# Altium project roneCPUBoard-v10.PrjPCB
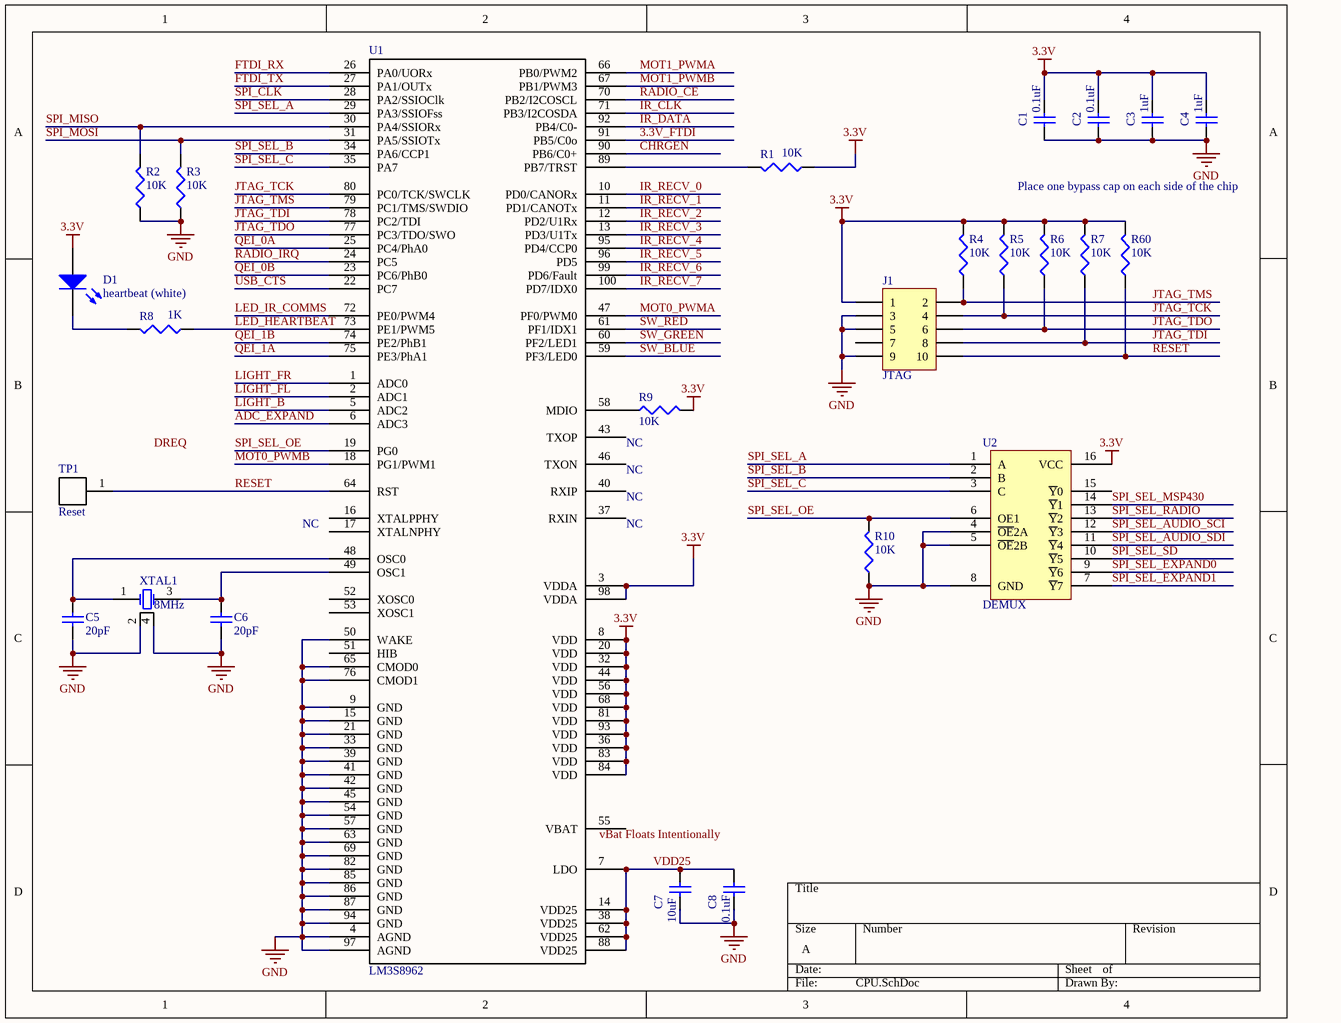
[diagram p0: CPU.SchDoc]
7 sheets, 179 parts. Net scope: global (net labels, ports and power ports of the same name join across sheets).
Board file: roneCPUBoard-v10.PcbDoc
Sheets:
  CPU.SchDoc
  USBHeaders.SchDoc
  IRComms.SchDoc
  LEDs.SchDoc
  LightSensorsButtons.SchDoc
  SoundChip.SchDoc
  TestPoints.SchDoc

## Sheet CPU.SchDoc
size A; PageSetup: Record=PageOptions|CenterHorizontal=True|CenterVertical=True|PrintScale=1.05|XCorrection=1.00|YCorrection=1.00|PrintKind=1|BorderSize=5000000|LeftOffset=0|BottomOffset=0|Orientation=2|PaperLength=1000|PaperWidth=1000|Scale=100|PaperSource=262|PrintQuality=600|MediaType=1|DitherType=10|PaperKind=Letter|PrintScaleMode=1

### Parts
C1  value 0.1uF  [CAPC1005L]  (hidden comment: Cap Semi)
C2  value 0.1uF  [CAPC1005L]  (hidden comment: Cap Semi)
C3  value 1uF  [CAPC1608L]  (hidden comment: Cap Semi)
C4  value 1uF  [CAPC1608L]  (hidden comment: Cap Semi)
C5  value 20pF  [CAPC1005L]  (hidden comment: Cap Semi)
C6  value 20pF  [CAPC1005L]  (hidden comment: Cap Semi)
C7  value 10uF  [CAPC1608L]  (hidden comment: Cap Semi)
C8  value 0.1uF  [CAPC1005L]  (hidden comment: Cap Semi)
D1  heartbeat (white)  [SurfaceMount(603)]
J1  JTAG  [JTAG-10]
R1  value 10K  [RESC1608L]  (hidden comment: Res3)
R2  value 10K  [RESC1608L]  (hidden comment: Res3)
R3  value 10K  [RESC1608L]  (hidden comment: Res3)
R4  value 10K  [RESC1608L]  (hidden comment: Res3)
R5  value 10K  [RESC1608L]  (hidden comment: Res3)
R6  value 10K  [RESC1608L]  (hidden comment: Res3)
R7  value 10K  [RESC1608L]  (hidden comment: Res3)
R8  value 1K  [RESC1608L]  (hidden comment: Res3)
R9  value 10K  [RESC1608L]  (hidden comment: Res3)
R10  value 10K  [RESC1608L]  (hidden comment: Res3)
R60  value 10K  [RESC1608L]  (hidden comment: Res3)
TP1  Reset  [TestPoint]
U1  LM3S8962  [LQFP-100]
U2  DEMUX  [TSSOP-16]
XTAL1  8MHz  [CRYSTAL]

### Nets
3.3V: C1.2 C2.2 C3.2 C4.2 D1.1(A) J1.1 R1.1 R4.2 R5.2 R6.2 R7.2 R9.2 R60.2 U1.3(VDDA) U1.8(VDD) U1.20(VDD) U1.32(VDD) U1.36(VDD) U1.44(VDD) U1.56(VDD) U1.68(VDD) U1.81(VDD) U1.83(VDD) U1.84(VDD) U1.93(VDD) U1.98(VDDA) U2.16(VCC)
3.3V_FTDI: U1.91(PB5/C0o)
GND: C1.1 C2.1 C3.1 C4.1 C5.1 C6.1 C7.1 C8.1 J1.3 J1.5 J1.9 R2.1 R3.1 R10.1 U1.4(AGND) U1.9(GND) U1.15(GND) U1.21(GND) U1.33(GND) U1.39(GND) U1.41(GND) U1.42(GND) U1.45(GND) U1.50(WAKE) U1.54(GND) U1.57(GND) U1.63(GND) U1.65(CMOD0) U1.69(GND) U1.76(CMOD1) U1.82(GND) U1.85(GND) U1.86(GND) U1.87(GND) U1.94(GND) U1.97(AGND) U2.4(~{OE}2A) U2.5(~{OE}2B) U2.8(GND) XTAL1.2(GND) XTAL1.4(GND)
ADC_EXPAND: U1.6(ADC3)
CHRGEN: U1.90(PB6/C0+)
FTDI_RX: U1.26(PA0/UORx)
FTDI_TX: U1.27(PA1/OUTx)
IR_CLK: U1.71(PB3/I2COSDA)
IR_DATA: U1.92(PB4/C0-)
IR_RECV_0: U1.10(PD0/CANORx)
IR_RECV_1: U1.11(PD1/CANOTx)
IR_RECV_2: U1.12(PD2/U1Rx)
IR_RECV_3: U1.13(PD3/U1Tx)
IR_RECV_4: U1.95(PD4/CCP0)
IR_RECV_5: U1.96(PD5)
IR_RECV_6: U1.99(PD6/Fault)
IR_RECV_7: U1.100(PD7/IDX0)
JTAG_TCK: J1.4 R5.1 U1.80(PC0/TCK/SWCLK)
JTAG_TDI: J1.8 R7.1 U1.78(PC2/TDI)
JTAG_TDO: J1.6 R6.1 U1.77(PC3/TDO/SWO)
JTAG_TMS: J1.2 R4.1 U1.79(PC1/TMS/SWDIO)
LED_HEARTBEAT: R8.1 U1.73(PE1/PWM5)
LED_IR_COMMS: U1.72(PE0/PWM4)
LIGHT_B: U1.5(ADC2)
LIGHT_FL: U1.2(ADC1)
LIGHT_FR: U1.1(ADC0)
MOT0_PWMA: U1.47(PF0/PWM0)
MOT0_PWMB: U1.18(PG1/PWM1)
MOT1_PWMA: U1.66(PB0/PWM2)
MOT1_PWMB: U1.67(PB1/PWM3)
QEI_0A: U1.25(PC4/PhA0)
QEI_0B: U1.23(PC6/PhB0)
QEI_1A: U1.75(PE3/PhA1)
QEI_1B: U1.74(PE2/PhB1)
RADIO_CE: U1.70(PB2/I2COSCL)
RADIO_IRQ: U1.24(PC5)
RESET: J1.10 R60.1 TP1.1 U1.64(RST)
SPI_CLK: U1.28(PA2/SSIOClk)
SPI_MISO: R2.2 U1.30(PA4/SSIORx)
SPI_MOSI: R3.2 U1.31(PA5/SSIOTx)
SPI_SEL_A: U1.29(PA3/SSIOFss) U2.1(A)
SPI_SEL_AUDIO_SCI: U2.12(~{Y}3)
SPI_SEL_AUDIO_SDI: U2.11(~{Y}4)
SPI_SEL_B: U1.34(PA6/CCP1) U2.2(B)
SPI_SEL_C: U1.35(PA7) U2.3(C)
SPI_SEL_EXPAND0: U2.9(~{Y}6)
SPI_SEL_EXPAND1: U2.7(~{Y}7)
SPI_SEL_MSP430: U2.14(~{Y}1)
SPI_SEL_OE: R10.2 U1.19(PG0) U2.6(OE1)
SPI_SEL_RADIO: U2.13(~{Y}2)
SPI_SEL_SD: U2.10(~{Y}5)
SW_BLUE: U1.59(PF3/LED0)
SW_GREEN: U1.60(PF2/LED1)
SW_RED: U1.61(PF1/IDX1)
USB_CTS: U1.22(PC7)
VDD25: C7.2 C8.2 U1.7(LDO) U1.14(VDD25) U1.38(VDD25) U1.62(VDD25) U1.88(VDD25)
NetC5_2: C5.2 U1.48(OSC0) XTAL1.1(OSC1)
NetC6_2: C6.2 U1.49(OSC1) XTAL1.3(OSC2)
NetD1_2: D1.2(K) R8.2
NetR1_2: R1.2 U1.89(PB7/TRST)
NetR9_1: R9.1 U1.58(MDIO)

Not connected (* = marked no-connect by the designer): J1 7; U1 16(XTALPPHY) 17(XTALNPHY) 37(RXIN) 40(RXIP) 43(TXOP) 46(TXON) 51(HIB) 52(XOSC0) 53(XOSC1) 55(VBAT); U2 15(~{Y}0)

### Notes on the sheet
- Place one bypass cap on each side of the chip
- NC
- (near U1) NC
- (near U1) vBat Floats Intentionally
- Labels drawn without touching a wire or pin: DREQ

### Library data of the parts
C1-C8 = Cap Semi: Capacitor (Semiconductor SIM Model); Published: 8-Jun-2000; LatestRevisionDate: 29-May-2009; LatestRevisionNote: IPC-7351 Footprint Added.; PackageReference: C1206; Publisher: Altium Limited; PackageDescription: Chip Capacitor
D1 = LED
J1 = Header 5X2H: Header, 5-Pin, Dual row, Right Angle; LatestRevisionDate: 17-Jul-2002; LatestRevisionNote: Re-released for DXP Platform.; Publisher: Altium Limited
R1-R10 R60 = Res3: Resistor; Published: 8-Jun-2000; LatestRevisionDate: 29-May-2009; LatestRevisionNote: IPC-7351 Footprint Added.; PackageReference: J1-0603; Publisher: Altium Limited; PackageDescription: Chip Resistor
TP1 = TestPoint
XTAL1 = Crystal

## Sheet USBHeaders.SchDoc
size A
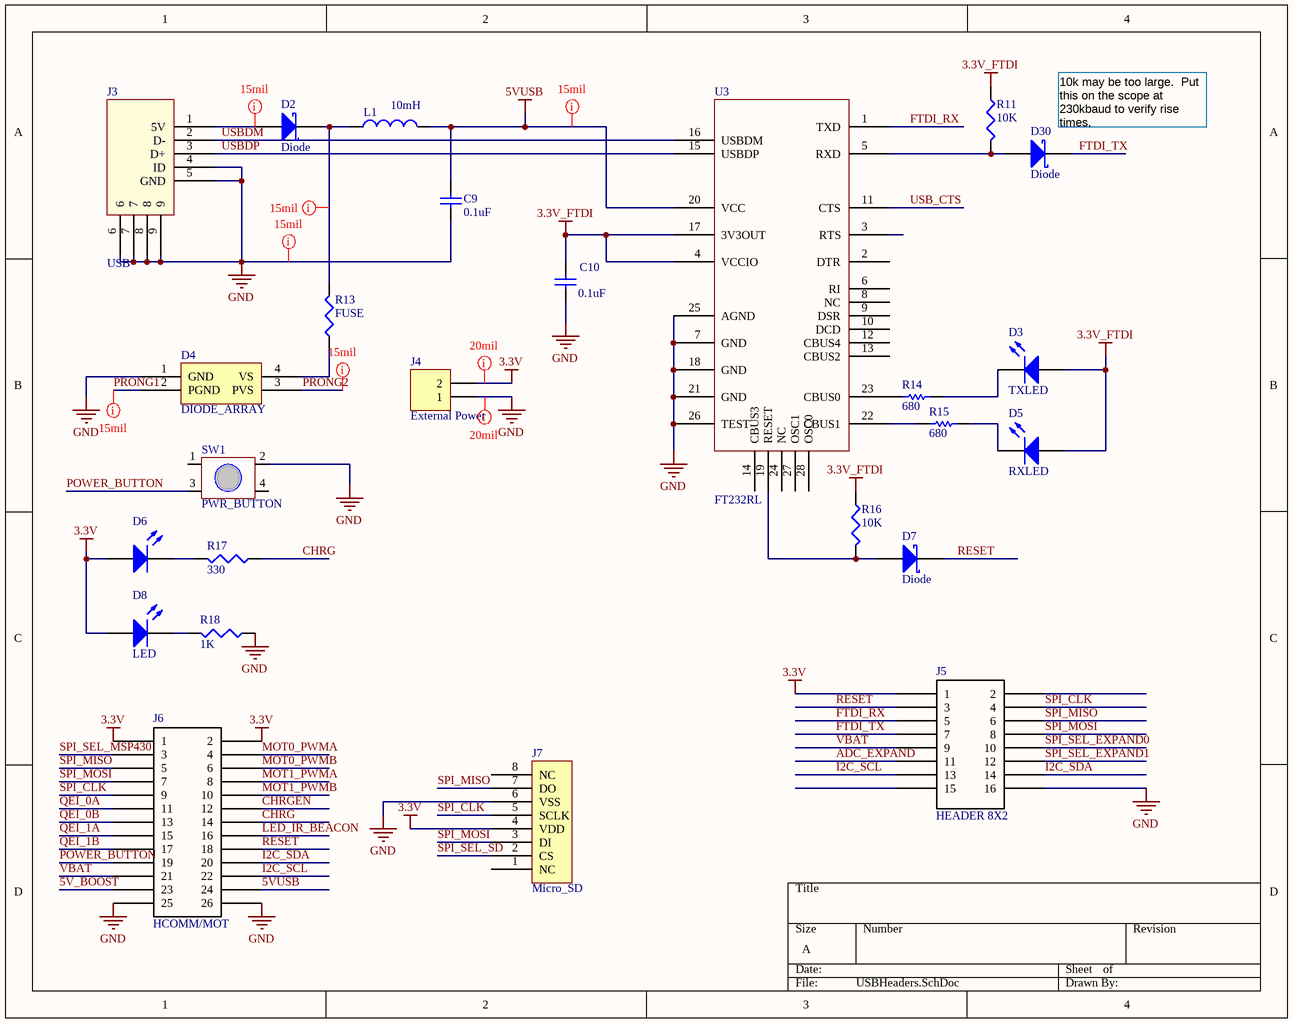
[diagram p1: USBHeaders.SchDoc]

### Parts
C9  value 0.1uF  [CAPC1005L]
C10  value 0.1uF  [CAPC1005L]
D2  Diode  [SurfaceMount(603)]
D3  TXLED  [INDC2012L]
D4  DIODE_ARRAY  [SOT143]
D5  RXLED  [INDC2012L]
D6  Charge  [INDC2012L]  (value not drawn)
D7  Diode  [SurfaceMount(603)]
D8  LED  [SurfaceMount(603)]
D30  Diode  [SurfaceMount(603)]
J3  USB  [USB Minib (thru-hole)]
J4  External Power  [HDR1X2]
J5  HEADER 8X2  [HEADERSM 8X2]
J6  HCOMM/MOT  [HeaderSM 13x2]
J7  Micro_SD  [MICRO_SD]
L1  value 10mH  [INDC2012L]  (hidden comment: Inductor)
R11  value 10K  [RESC1608L]  (hidden comment: Res3)
R13  value FUSE  [RESC3225L]  (hidden comment: Res3)
R14  value 680  [RESC1608L]
R15  value 680  [RESC1608L]
R16  value 10K  [RESC1608L]  (hidden comment: Res3)
R17  value 330  [RESC1608L]  (hidden comment: Res3)
R18  value 1K  [RESC1608L]  (hidden comment: Res3)
SW1  PWR_BUTTON  [SwitchTall-TL330]
U3  FT232RL  [SSOP-28]

### Nets
3.3V: D6.1(A) D8.1(A) J4.2 J5.1 J6.1 J6.2 J7.4(VDD)
3.3V_FTDI: C10.2 D3.1(A) D5.1(A) R11.1 R16.1 U3.4(VCCIO) U3.17(3V3OUT)
5V_BOOST: J6.23
5VUSB: C9.2 J6.24 L1.2 U3.20(VCC)
GND: C9.1 C10.1 D4.1(GND) J3.4(ID) J3.5(GND) J3.6 J3.7 J3.8 J3.9 J4.1 J5.16 J6.25 J6.26 J7.6(VSS) R18.1 SW1.2 U3.7(GND) U3.18(GND) U3.21(GND) U3.25(AGND) U3.26(TEST)
ADC_EXPAND: J5.11
CHRG: J6.14 R17.1
CHRGEN: J6.12
FTDI_RX: J5.5 U3.1(TXD)
FTDI_TX: D30.1(K) J5.7
I2C_SCL: J5.13 J6.22
I2C_SDA: J5.14 J6.20
LED_IR_BEACON: J6.16
MOT0_PWMA: J6.4
MOT0_PWMB: J6.6
MOT1_PWMA: J6.8
MOT1_PWMB: J6.10
POWER_BUTTON: J6.19 SW1.3
PRONG1: D4.2(PGND)
PRONG2: D4.3(PVS)
QEI_0A: J6.11
QEI_0B: J6.13
QEI_1A: J6.15
QEI_1B: J6.17
RESET: D7.1(K) J5.3 J6.18
SPI_CLK: J5.4 J6.9 J7.5(SCLK)
SPI_MISO: J5.6 J6.5 J7.7(DO)
SPI_MOSI: J5.8 J6.7 J7.3(DI)
SPI_SEL_EXPAND0: J5.10
SPI_SEL_EXPAND1: J5.12
SPI_SEL_MSP430: J6.3
SPI_SEL_SD: J7.2(CS)
USB_CTS: U3.11(CTS)
USBDM: J3.2(D-) U3.16(USBDM)
USBDP: J3.3(D+) U3.15(USBDP)
VBAT: J5.9 J6.21
NetD2_1: D2.1(K) L1.1 R13.2
NetD2_2: D2.2(A) J3.1(5V)
NetD3_2: D3.2(K) R14.2
NetD4_4: D4.4(VS) R13.1
NetD5_2: D5.2(K) R15.2
NetD6_2: D6.2(K) R17.2
NetD7_2: D7.2(A) R16.2 U3.19(RESET)
NetD8_2: D8.2(K) R18.2
NetD30_2: D30.2(A) R11.2 U3.5(RXD)
NetR14_1: R14.1 U3.23(CBUS0)
NetR15_1: R15.1 U3.22(CBUS1)

Not connected (* = marked no-connect by the designer): J5 2 15; J7 1(NC) 8(NC); SW1 1 4; U3 2(DTR) 3(RTS) 6(RI) 8(NC) 9(DSR) 10(DCD) 12(CBUS4) 13(CBUS2) 14(CBUS3) 24(NC) 27(OSC1) 28(OSC0)

### Layout directives
rule Width Constraint [Pref Width = 15mil    Min Width = 8mil    Max Width = 20mil]: 3.3V, GND
rule Width Constraint [Pref Width = 8mil    Min Width = 8mil    Max Width = 15mil]: 5VUSB, GND, NetD2_1, NetD2_2, PRONG1, PRONG2

### Notes on the sheet
- (near D30) 10k may be too large.  Put this on the scope at 230kbaud to verify rise times.

### Library data of the parts
C9 C10 = Cap: Capacitor; Published: 8-Jun-2000; LatestRevisionDate: 17-Jul-2002; LatestRevisionNote: Re-released for DXP Platform.; PackageReference: RAD-0.3; Publisher: Altium Limited
D2 D7 D30 = SchottkeyDiode
D3 D5 D6 = LED2: Typical RED, GREEN, YELLOW, AMBER GaAs LED; Published: 8-Jun-2000; LatestRevisionDate: 17-Jul-2002; LatestRevisionNote: Re-released for DXP Platform.; PackageVersion: Feb-2002; PackageReference: 3.2X1.6X1.1; Publisher: Altium Limited
D4 = SCHOTTKEY_DIODE_ARRAY
J3 = USB-ConnTH
J4 = Header 2: Header, 2-Pin; LatestRevisionDate: 17-Jul-2002; LatestRevisionNote: Re-released for DXP Platform.; Publisher: Altium Limited
J5 = HEADERS 8X2
J6 = HCOMM/HMOT: Header, 2X20, 50mil, IDC
L1 = Inductor: Code_IEC: 1005; Published: 8-Jun-2000; LatestRevisionDate: 29-May-2009; LatestRevisionNote: IPC-7351 Footprint Added.; PackageReference: 0402-A; Publisher: Altium Limited; PackageDescription: Chip Inductor; Code_JEITA: 0402
R11 R13 R16-R18 = Res3: Resistor; Published: 8-Jun-2000; LatestRevisionDate: 29-May-2009; LatestRevisionNote: IPC-7351 Footprint Added.; PackageReference: J1-0603; Publisher: Altium Limited; PackageDescription: Chip Resistor
R14 R15 = Res1: Resistor; Published: 8-Jun-2000; LatestRevisionDate: 17-Jul-2002; LatestRevisionNote: Re-released for DXP Platform.; PackageReference: AXIAL-0.3; Publisher: Altium Limited
SW1 = Switch-TL330

## Sheet IRComms.SchDoc
size A
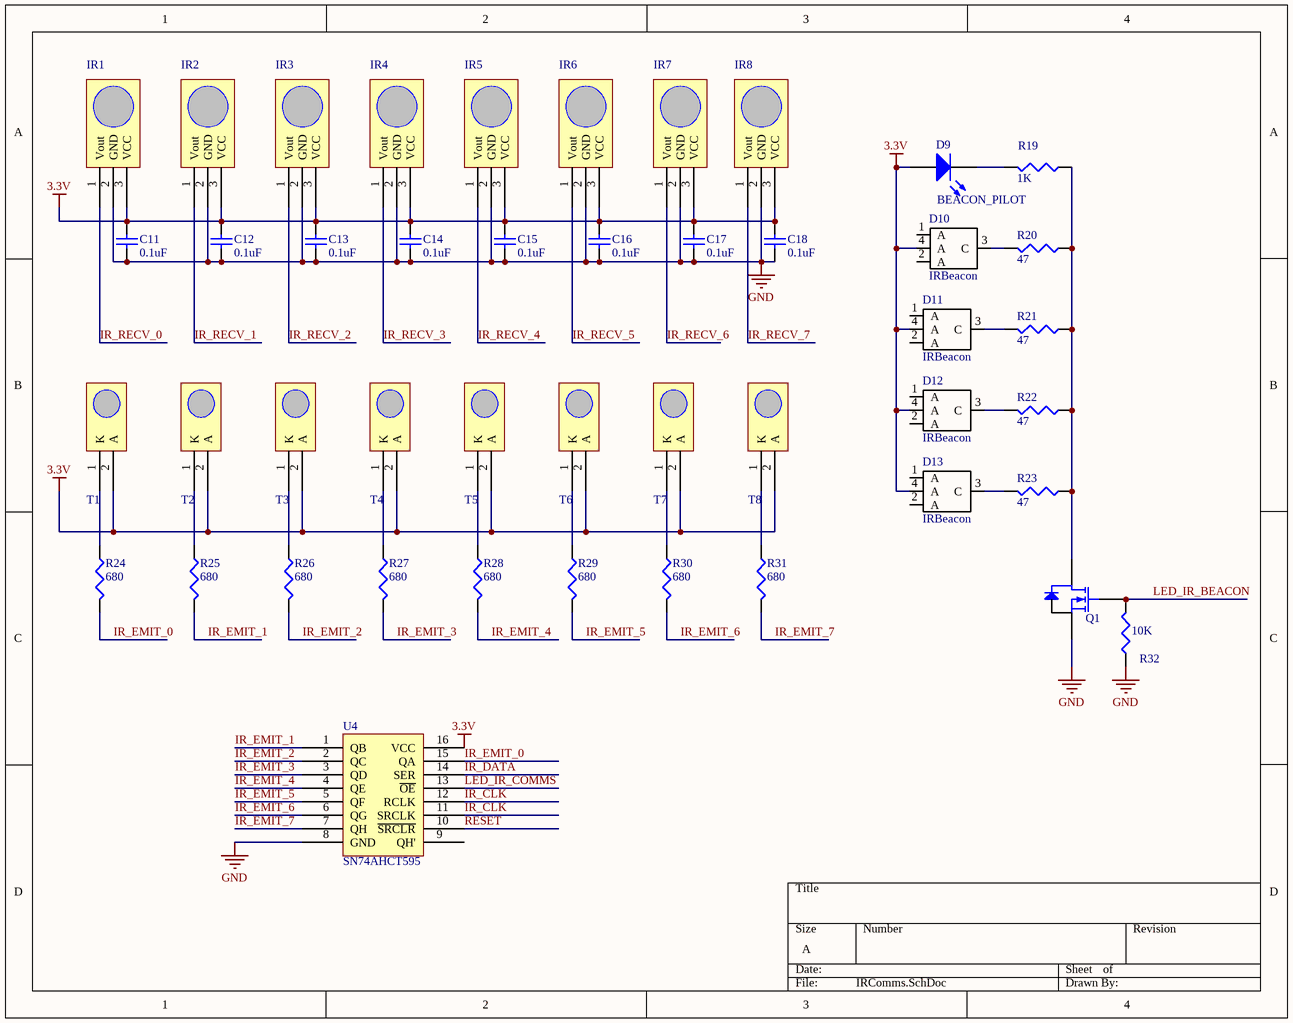
[diagram p2: IRComms.SchDoc]

### Parts
C11  value 0.1uF  [CAPC1005L]  (hidden comment: Cap Semi)
C12  value 0.1uF  [CAPC1005L]  (hidden comment: Cap Semi)
C13  value 0.1uF  [CAPC1005L]  (hidden comment: Cap Semi)
C14  value 0.1uF  [CAPC1005L]  (hidden comment: Cap Semi)
C15  value 0.1uF  [CAPC1005L]  (hidden comment: Cap Semi)
C16  value 0.1uF  [CAPC1005L]  (hidden comment: Cap Semi)
C17  value 0.1uF  [CAPC1005L]  (hidden comment: Cap Semi)
C18  value 0.1uF  [CAPC1005L]  (hidden comment: Cap Semi)
D9  BEACON_PILOT  [SurfaceMount(603)]
D10  IRBeacon  [IRBeacon]
D11  IRBeacon  [IRBeacon]
D12  IRBeacon  [IRBeacon]
D13  IRBeacon  [IRBeacon]
IR1  GP1UX31QS  [GP1UX31QS]  (value not drawn)
IR2  GP1UX31QS  [GP1UX31QS]  (value not drawn)
IR3  GP1UX31QS  [GP1UX31QS]  (value not drawn)
IR4  GP1UX31QS  [GP1UX31QS]  (value not drawn)
IR5  GP1UX31QS  [GP1UX31QS]  (value not drawn)
IR6  GP1UX31QS  [GP1UX31QS]  (value not drawn)
IR7  GP1UX31QS  [GP1UX31QS]  (value not drawn)
IR8  GP1UX31QS  [GP1UX31QS]  (value not drawn)
Q1  Mosfet  [SOT-23]  (value not drawn)
R19  value 1K  [RESC1608L]  (hidden comment: Res3)
R20  value 47  [RESC1608L]  (hidden comment: Res3)
R21  value 47  [RESC1608L]  (hidden comment: Res3)
R22  value 47  [RESC1608L]  (hidden comment: Res3)
R23  value 47  [RESC1608L]  (hidden comment: Res3)
R24  value 680  [RESC1608L]  (hidden comment: Res3)
R25  value 680  [RESC1608L]  (hidden comment: Res3)
R26  value 680  [RESC1608L]  (hidden comment: Res3)
R27  value 680  [RESC1608L]  (hidden comment: Res3)
R28  value 680  [RESC1608L]  (hidden comment: Res3)
R29  value 680  [RESC1608L]  (hidden comment: Res3)
R30  value 680  [RESC1608L]  (hidden comment: Res3)
R31  value 680  [RESC1608L]  (hidden comment: Res3)
R32  value 10K  [RESC1608L]  (hidden comment: Res3)
T1  LN54  [LN54]  (value not drawn)
T2  LN54  [LN54]  (value not drawn)
T3  LN54  [LN54]  (value not drawn)
T4  LN54  [LN54]  (value not drawn)
T5  LN54  [LN54]  (value not drawn)
T6  LN54  [LN54]  (value not drawn)
T7  LN54  [LN54]  (value not drawn)
T8  LN54  [LN54]  (value not drawn)
U4  SN74AHCT595  [TSSOP-16]

### Nets
3.3V: C11.2 C12.2 C13.2 C14.2 C15.2 C16.2 C17.2 C18.2 D9.1(A) D10.4(A) D11.4(A) D12.4(A) D13.4(A) IR1.3(VCC) IR2.3(VCC) IR3.3(VCC) IR4.3(VCC) IR5.3(VCC) IR6.3(VCC) IR7.3(VCC) IR8.3(VCC) T1.2(A) T2.2(A) T3.2(A) T4.2(A) T5.2(A) T6.2(A) T7.2(A) T8.2(A) U4.16(VCC)
GND: C11.1 C12.1 C13.1 C14.1 C15.1 C16.1 C17.1 C18.1 IR1.2(GND) IR2.2(GND) IR3.2(GND) IR4.2(GND) IR5.2(GND) IR6.2(GND) IR7.2(GND) IR8.2(GND) Q1.2(S) R32.1 U4.8(GND)
IR_CLK: U4.11(SRCLK) U4.12(RCLK)
IR_DATA: U4.14(SER)
IR_EMIT_0: R24.2 U4.15(QA)
IR_EMIT_1: R25.2 U4.1(QB)
IR_EMIT_2: R26.2 U4.2(QC)
IR_EMIT_3: R27.2 U4.3(QD)
IR_EMIT_4: R28.2 U4.4(QE)
IR_EMIT_5: R29.2 U4.5(QF)
IR_EMIT_6: R30.2 U4.6(QG)
IR_EMIT_7: R31.2 U4.7(QH)
IR_RECV_0: IR1.1(Vout)
IR_RECV_1: IR2.1(Vout)
IR_RECV_2: IR3.1(Vout)
IR_RECV_3: IR4.1(Vout)
IR_RECV_4: IR5.1(Vout)
IR_RECV_5: IR6.1(Vout)
IR_RECV_6: IR7.1(Vout)
IR_RECV_7: IR8.1(Vout)
LED_IR_BEACON: Q1.1(G) R32.2
LED_IR_COMMS: U4.13(~{OE})
RESET: U4.10(~{SRCLR})
NetD9_2: D9.2(K) R19.2
NetD10_3: D10.3(C) R20.2
NetD11_3: D11.3(C) R21.2
NetD12_3: D12.3(C) R22.2
NetD13_3: D13.3(C) R23.2
NetQ1_3: Q1.3(D) R19.1 R20.1 R21.1 R22.1 R23.1
NetR24_1: R24.1 T1.1(K)
NetR25_1: R25.1 T2.1(K)
NetR26_1: R26.1 T3.1(K)
NetR27_1: R27.1 T4.1(K)
NetR28_1: R28.1 T5.1(K)
NetR29_1: R29.1 T6.1(K)
NetR30_1: R30.1 T7.1(K)
NetR31_1: R31.1 T8.1(K)

Not connected (* = marked no-connect by the designer): D10 1(A) 2(A); D11 1(A) 2(A); D12 1(A) 2(A); D13 1(A) 2(A); U4 9(QH')

### Library data of the parts
C11-C18 = Cap Semi: Capacitor (Semiconductor SIM Model); Published: 8-Jun-2000; LatestRevisionDate: 29-May-2009; LatestRevisionNote: IPC-7351 Footprint Added.; PackageReference: C1206; Publisher: Altium Limited; PackageDescription: Chip Capacitor
D9 = LED
R19-R32 = Res3: Resistor; Published: 8-Jun-2000; LatestRevisionDate: 29-May-2009; LatestRevisionNote: IPC-7351 Footprint Added.; PackageReference: J1-0603; Publisher: Altium Limited; PackageDescription: Chip Resistor
U4 = SN74AHCT595: shift register

## Sheet LEDs.SchDoc
size A
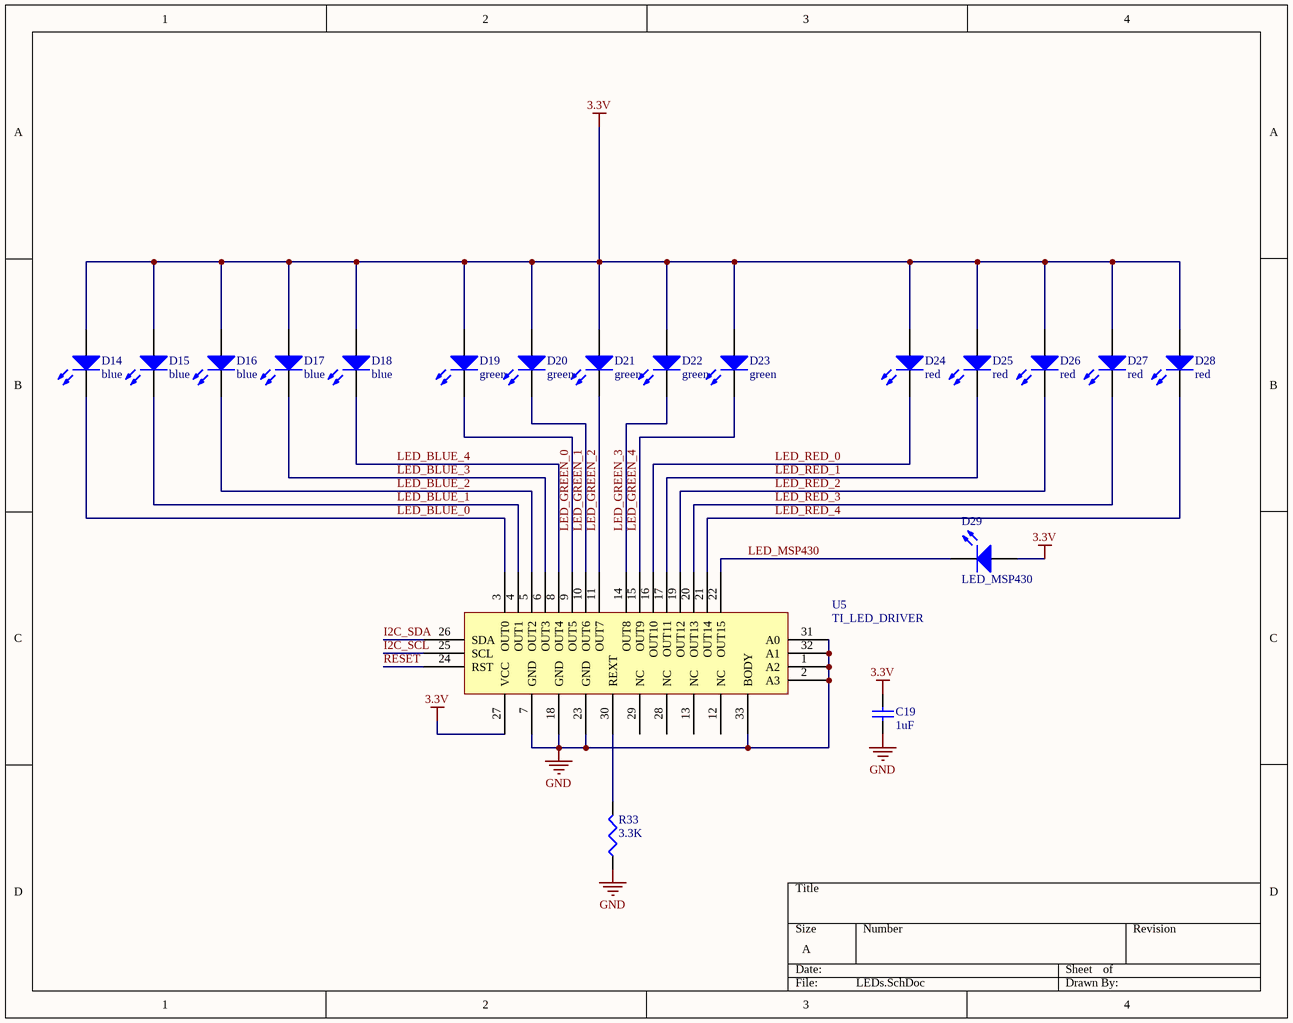
[diagram p3: LEDs.SchDoc]

### Parts
C19  value 1uF  [CAPC1608L]  (hidden comment: Cap Semi)
D14  blue  [SurfaceMount(603)]
D15  blue  [SurfaceMount(603)]
D16  blue  [SurfaceMount(603)]
D17  blue  [SurfaceMount(603)]
D18  blue  [SurfaceMount(603)]
D19  green  [SurfaceMount(603)]
D20  green  [SurfaceMount(603)]
D21  green  [SurfaceMount(603)]
D22  green  [SurfaceMount(603)]
D23  green  [SurfaceMount(603)]
D24  red  [SurfaceMount(603)]
D25  red  [SurfaceMount(603)]
D26  red  [SurfaceMount(603)]
D27  red  [SurfaceMount(603)]
D28  red  [SurfaceMount(603)]
D29  LED_MSP430  [SurfaceMount(603)]
R33  value 3.3K  [RESC1608L]  (hidden comment: Res3)
U5  TI_LED_DRIVER  [QFN32-LEDTLC59116]

### Nets
3.3V: C19.2 D14.1(A) D15.1(A) D16.1(A) D17.1(A) D18.1(A) D19.1(A) D20.1(A) D21.1(A) D22.1(A) D23.1(A) D24.1(A) D25.1(A) D26.1(A) D27.1(A) D28.1(A) D29.1(A) U5.27(VCC)
GND: C19.1 R33.1 U5.1(A2) U5.2(A3) U5.7(GND) U5.18(GND) U5.23(GND) U5.31(A0) U5.32(A1) U5.33(BODY)
I2C_SCL: U5.25(SCL)
I2C_SDA: U5.26(SDA)
LED_BLUE_0: D14.2(K) U5.3(OUT0)
LED_BLUE_1: D15.2(K) U5.4(OUT1)
LED_BLUE_2: D16.2(K) U5.5(OUT2)
LED_BLUE_3: D17.2(K) U5.6(OUT3)
LED_BLUE_4: D18.2(K) U5.8(OUT4)
LED_GREEN_0: D19.2(K) U5.9(OUT5)
LED_GREEN_1: D20.2(K) U5.10(OUT6)
LED_GREEN_2: D21.2(K) U5.11(OUT7)
LED_GREEN_3: D22.2(K) U5.14(OUT8)
LED_GREEN_4: D23.2(K) U5.15(OUT9)
LED_MSP430: D29.2(K) U5.22(OUT15)
LED_RED_0: D24.2(K) U5.16(OUT10)
LED_RED_1: D25.2(K) U5.17(OUT11)
LED_RED_2: D26.2(K) U5.19(OUT12)
LED_RED_3: D27.2(K) U5.20(OUT13)
LED_RED_4: D28.2(K) U5.21(OUT14)
RESET: U5.24(RST)
NetR33_2: R33.2 U5.30(REXT)

Not connected (* = marked no-connect by the designer): U5 12(NC) 13(NC) 28(NC) 29(NC)

### Library data of the parts
C19 = Cap Semi: Capacitor (Semiconductor SIM Model); Published: 8-Jun-2000; LatestRevisionDate: 29-May-2009; LatestRevisionNote: IPC-7351 Footprint Added.; PackageReference: C1206; Publisher: Altium Limited; PackageDescription: Chip Capacitor
D14-D29 = LED
R33 = Res3: Resistor; Published: 8-Jun-2000; LatestRevisionDate: 29-May-2009; LatestRevisionNote: IPC-7351 Footprint Added.; PackageReference: J1-0603; Publisher: Altium Limited; PackageDescription: Chip Resistor
U5 = TLC59116LEDDRIVER

## Sheet LightSensorsButtons.SchDoc
size A
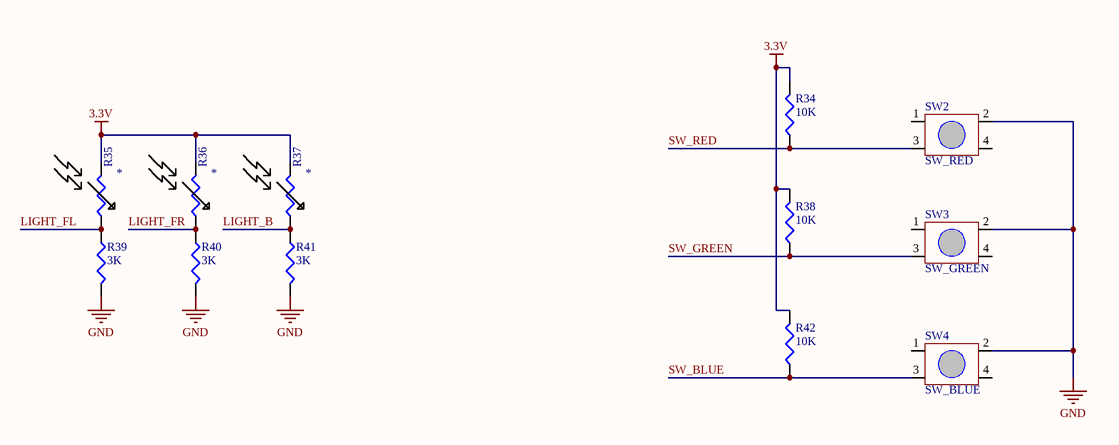
[diagram p4: LightSensorsButtons.SchDoc]

### Parts
R34  value 10K  [RESC1608L]  (hidden comment: Res3)
R35  photoresistor  [photoresistor]  (value not drawn)
R36  photoresistor  [photoresistor]  (value not drawn)
R37  photoresistor  [photoresistor]  (value not drawn)
R38  value 10K  [RESC1608L]  (hidden comment: Res3)
R39  value 3K  [RESC1608L]  (hidden comment: Res3)
R40  value 3K  [RESC1608L]  (hidden comment: Res3)
R41  value 3K  [RESC1608L]  (hidden comment: Res3)
R42  value 10K  [RESC1608L]  (hidden comment: Res3)
SW2  SW_RED  [SwitchTall-TL330]
SW3  SW_GREEN  [SwitchTall-TL330]
SW4  SW_BLUE  [SwitchTall-TL330]

### Nets
3.3V: R34.2 R35.2 R36.2 R37.2 R38.2 R42.2
GND: R39.2 R40.2 R41.2 SW2.2 SW3.2 SW4.2
LIGHT_B: R37.1 R41.1
LIGHT_FL: R35.1 R39.1
LIGHT_FR: R36.1 R40.1
SW_BLUE: R42.1 SW4.3
SW_GREEN: R38.1 SW3.3
SW_RED: R34.1 SW2.3

Not connected (* = marked no-connect by the designer): SW2 1 4; SW3 1 4; SW4 1 4

### Library data of the parts
R34 R38-R42 = Res3: Resistor; Published: 8-Jun-2000; LatestRevisionDate: 29-May-2009; LatestRevisionNote: IPC-7351 Footprint Added.; PackageReference: J1-0603; Publisher: Altium Limited; PackageDescription: Chip Resistor
SW2-SW4 = Switch-TL330
R35-R37 = photoresistor: Value: *

## Sheet SoundChip.SchDoc
size A
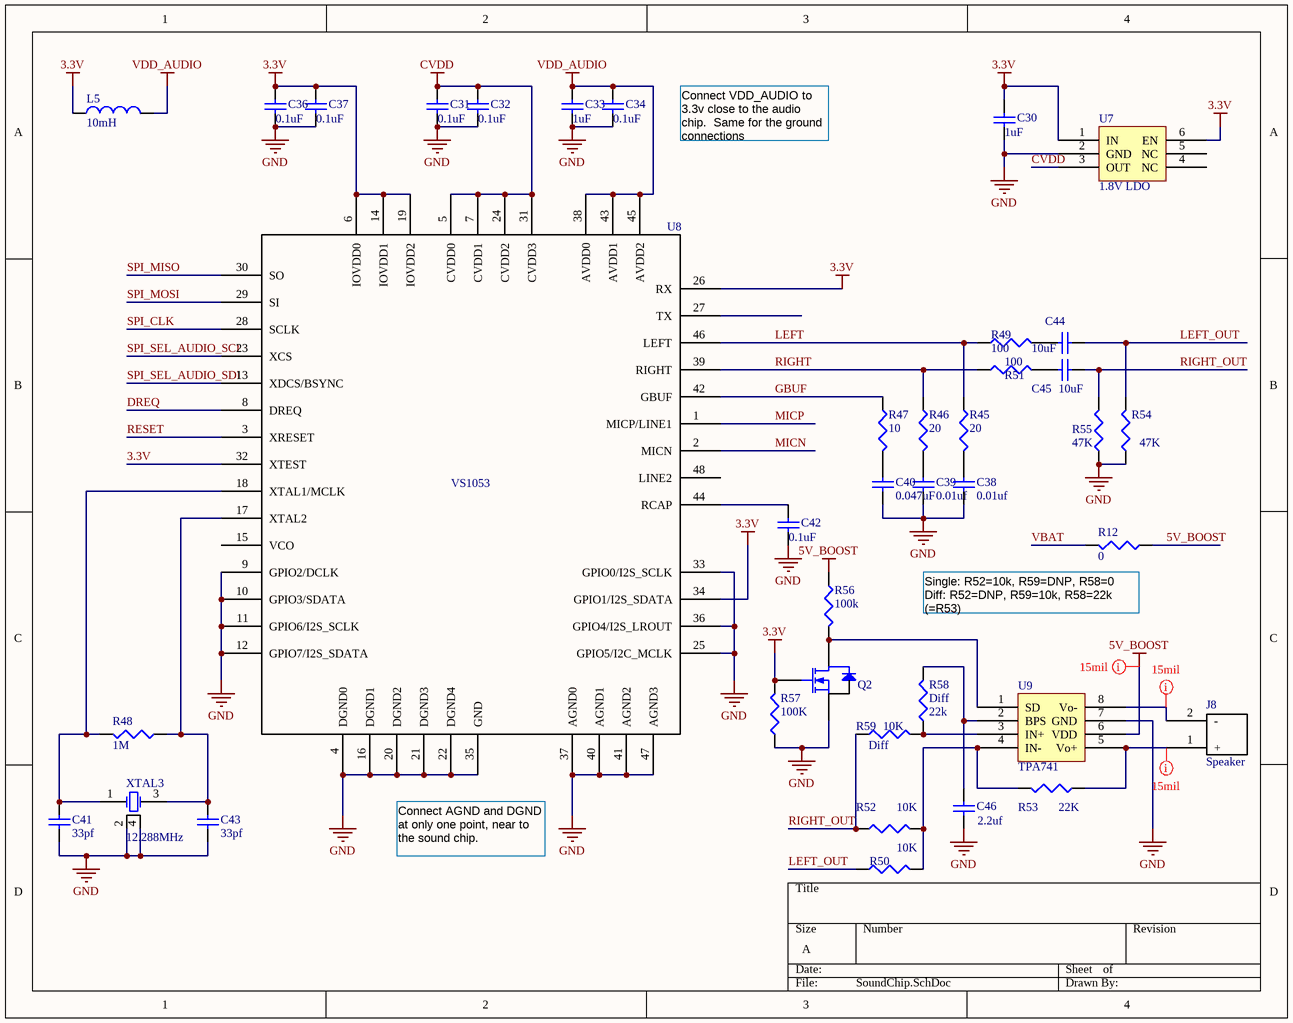
[diagram p5: SoundChip.SchDoc]

### Parts
C30  value 1uF  [CAPC1608L]  (hidden comment: Cap Semi)
C31  value 0.1uF  [CAPC1005L]  (hidden comment: Cap Semi)
C32  value 0.1uF  [CAPC1005L]  (hidden comment: Cap Semi)
C33  value 1uF  [CAPC1608L]  (hidden comment: Cap Semi)
C34  value 0.1uF  [CAPC1005L]  (hidden comment: Cap Semi)
C36  value 0.1uF  [CAPC1005L]  (hidden comment: Cap Semi)
C37  value 0.1uF  [CAPC1005L]  (hidden comment: Cap Semi)
C38  value 0.01uf  [CAPC1005L]  (hidden comment: Cap Semi)
C39  value 0.01uf  [CAPC1005L]  (hidden comment: Cap Semi)
C40  value 0.047uF  [CAPC1005L]  (hidden comment: Cap Semi)
C41  value 33pf  [CAPC1005L]  (hidden comment: Cap Semi)
C42  value 0.1uF  [CAPC1005L]  (hidden comment: Cap Semi)
C43  value 33pf  [CAPC1005L]  (hidden comment: Cap Semi)
C44  value 10uF  [CAPC1608L]  (hidden comment: Cap Semi)
C45  value 10uF  [CAPC1608L]  (hidden comment: Cap Semi)
C46  value 2.2uf  [CAPC1608L]  (hidden comment: Cap Semi)
J8  Speaker  [BatteryConnJST]
L5  value 10mH  [INDC2012L]  (hidden comment: Inductor)
Q2  Mosfet  [SOT-23]  (value not drawn)
R12  value 0  [RESC1608L]  (hidden comment: Res3)
R45  value 20  [RESC1608L]  (hidden comment: Res3)
R46  value 20  [RESC1608L]  (hidden comment: Res3)
R47  value 10  [RESC1608L]  (hidden comment: Res3)
R48  value 1M  [RESC1608L]  (hidden comment: Res3)
R49  value 100  [RESC1608L]  (hidden comment: Res3)
R50  value 10K  [RESC1608L]  (hidden comment: Res3)
R51  value 100  [RESC1608L]  (hidden comment: Res3)
R52  value 10K  [RESC1608L]  (hidden comment: Res3)
R53  value 22K  [RESC1608L]  (hidden comment: Res3)
R54  value 47K  [RESC1608L]  (hidden comment: Res3)
R55  value 47K  [RESC1608L]  (hidden comment: Res3)
R56  value 100k  [RESC1608L]  (hidden comment: Res3)
R57  value 100K  [RESC1608L]  (hidden comment: Res3)
R58  Diff  value 22k  [RESC1608L]
R59  Diff  value 10K  [RESC1608L]
U7  1.8V LDO  [WFDFN-6]
U8  VS1053  [LQFP-48]
U9  TPA741  [audio amp]
XTAL3  12.288MHz  [CRYSTAL]

### Nets
3.3V: C30.1 C36.2 C37.2 L5.2 Q2.1(G) R57.2 U7.1(IN) U7.6(EN) U8.6(IOVDD0) U8.14(IOVDD1) U8.19(IOVDD2) U8.26(RX) U8.32(XTEST) U8.34(GPIO1/I2S_SDATA)
5V_BOOST: R12.1 R56.2 U9.6(VDD)
CVDD: C31.2 C32.2 U7.3(OUT) U8.5(CVDD0) U8.7(CVDD1) U8.24(CVDD2) U8.31(CVDD3)
GND: C30.2 C31.1 C32.1 C33.2 C34.1 C36.1 C37.1 C38.2 C39.2 C40.2 C41.2 C42.1 C43.2 C46.1 Q2.2(S) R54.1 R55.1 R57.1 U7.2(GND) U8.4(DGND0) U8.9(GPIO2/DCLK) U8.10(GPIO3/SDATA) U8.11(GPIO6/I2S_SCLK) U8.12(GPIO7/I2S_SDATA) U8.16(DGND1) U8.20(DGND2) U8.21(DGND3) U8.22(DGND4) U8.25(GPIO5/I2C_MCLK) U8.33(GPIO0/I2S_SCLK) U8.35(GND) U8.36(GPIO4/I2S_LROUT) U8.37(AGND0) U8.40(AGND1) U8.41(AGND2) U8.47(AGND3) U9.7(GND) XTAL3.2(GND) XTAL3.4(GND)
VDD_AUDIO: C33.1 C34.2 L5.1 U8.38(AVDD0) U8.43(AVDD1) U8.45(AVDD2)
DREQ: U8.8(DREQ)
GBUF: R47.1 U8.42(GBUF)
LEFT: R45.1 R49.1 U8.46(LEFT)
LEFT_OUT: C44.1 R50.1 R54.2
MICN: U8.2(MICN)
MICP: U8.1(MICP/LINE1)
RESET: U8.3(XRESET)
RIGHT: R46.1 R51.1 U8.39(RIGHT)
RIGHT_OUT: C45.1 R52.1 R55.2 R59.1
SPI_CLK: U8.28(SCLK)
SPI_MISO: U8.30(SO)
SPI_MOSI: U8.29(SI)
SPI_SEL_AUDIO_SCI: U8.23(XCS)
SPI_SEL_AUDIO_SDI: U8.13(XDCS/BSYNC)
VBAT: R12.2
NetC38_1: C38.1 R45.2
NetC39_1: C39.1 R46.2
NetC40_1: C40.1 R47.2
NetC41_1: C41.1 R48.2 U8.18(XTAL1/MCLK) XTAL3.1(OSC1)
NetC42_2: C42.2 U8.44(RCAP)
NetC43_1: C43.1 R48.1 U8.17(XTAL2) XTAL3.3(OSC2)
NetC44_2: C44.2 R49.2
NetC45_2: C45.2 R51.2
NetC46_2: C46.2 R58.2 U9.2(BPS)
NetJ8_1: J8.1(+) R53.1 U9.5(Vo+)
NetJ8_2: J8.2(-) U9.8(Vo-)
NetQ2_3: Q2.3(D) R56.1 U9.1(SD)
NetR50_2: R50.2 R52.2 R53.2 U9.4(IN-)
NetR58_1: R58.1 R59.2 U9.3(IN+)

Not connected (* = marked no-connect by the designer): U7 4(NC) 5(NC); U8 15(VCO) 27(TX) 48(LINE2)

### Layout directives
rule Width Constraint [Pref Width = 15mil    Min Width = 8mil    Max Width = 20mil]: 5V_BOOST, NetJ8_1, NetJ8_2

### Notes on the sheet
- Connect VDD_AUDIO to 3.3v close to the audio chip.  Same for the ground connections
- (near R12) Single: R52=10k, R59=DNP, R58=0
  Diff: R52=DNP, R59=10k, R58=22k (=R53)
- Connect AGND and DGND at only one point, near to the sound chip.

### Library data of the parts
C30-C34 C36-C46 = Cap Semi: Capacitor (Semiconductor SIM Model); Published: 8-Jun-2000; LatestRevisionDate: 29-May-2009; LatestRevisionNote: IPC-7351 Footprint Added.; PackageReference: C1206; Publisher: Altium Limited; PackageDescription: Chip Capacitor
J8 = BatteryConnJST
L5 = Inductor: Code_IEC: 1005; Published: 8-Jun-2000; LatestRevisionDate: 29-May-2009; LatestRevisionNote: IPC-7351 Footprint Added.; PackageReference: 0402-A; Publisher: Altium Limited; PackageDescription: Chip Inductor; Code_JEITA: 0402
R12 R45-R59 = Res3: Resistor; Published: 8-Jun-2000; LatestRevisionDate: 29-May-2009; LatestRevisionNote: IPC-7351 Footprint Added.; PackageReference: J1-0603; Publisher: Altium Limited; PackageDescription: Chip Resistor
U7 = 1.8V_LDO
U9 = Audio Amp TPA741
XTAL3 = Crystal

## Sheet TestPoints.SchDoc
size A
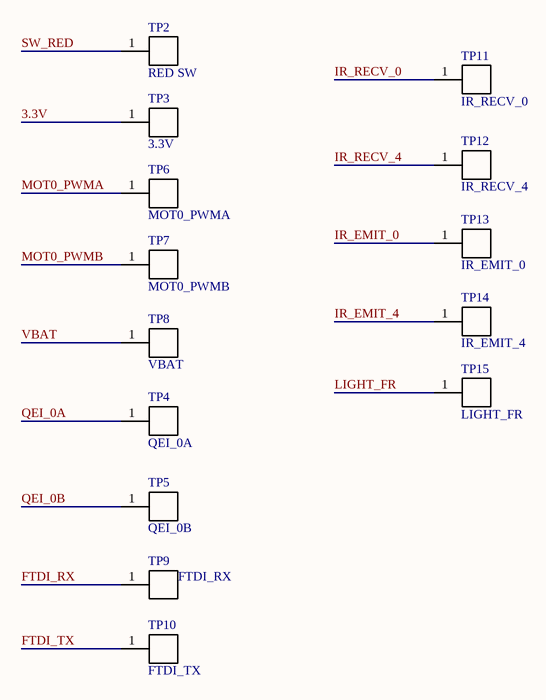
[diagram p6: TestPoints.SchDoc]

### Parts
TP2  RED SW  [TestPoint]
TP3  3.3V  [TestPoint]
TP4  QEI_0A  [TestPoint]
TP5  QEI_0B  [TestPoint]
TP6  MOT0_PWMA  [TestPoint]
TP7  MOT0_PWMB  [TestPoint]
TP8  VBAT  [TestPoint]
TP9  FTDI_RX  [TestPoint]
TP10  FTDI_TX  [TestPoint]
TP11  IR_RECV_0  [TestPoint]
TP12  IR_RECV_4  [TestPoint]
TP13  IR_EMIT_0  [TestPoint]
TP14  IR_EMIT_4  [TestPoint]
TP15  LIGHT_FR  [TestPoint]

### Nets
3.3V: TP3.1
FTDI_RX: TP9.1
FTDI_TX: TP10.1
IR_EMIT_0: TP13.1
IR_EMIT_4: TP14.1
IR_RECV_0: TP11.1
IR_RECV_4: TP12.1
LIGHT_FR: TP15.1
MOT0_PWMA: TP6.1
MOT0_PWMB: TP7.1
QEI_0A: TP4.1
QEI_0B: TP5.1
SW_RED: TP2.1
VBAT: TP8.1

### Library data of the parts
TP2-TP15 = TestPoint

## Nets that join several sheets
3.3V: CPU (27 pins), USBHeaders (7 pins), IRComms (30 pins), LEDs (18 pins), LightSensorsButtons (6 pins), SoundChip (14 pins), TestPoints (TP3.1)
3.3V_FTDI: CPU (U1.91), USBHeaders (7 pins)
5V_BOOST: USBHeaders (J6.23), SoundChip (R12.1 R56.2 U9.6)
GND: CPU (41 pins), USBHeaders (21 pins), IRComms (19 pins), LEDs (10 pins), LightSensorsButtons (6 pins), SoundChip (39 pins)
ADC_EXPAND: CPU (U1.6), USBHeaders (J5.11)
CHRGEN: CPU (U1.90), USBHeaders (J6.12)
FTDI_RX: CPU (U1.26), USBHeaders (J5.5 U3.1), TestPoints (TP9.1)
FTDI_TX: CPU (U1.27), USBHeaders (D30.1 J5.7), TestPoints (TP10.1)
I2C_SCL: USBHeaders (J5.13 J6.22), LEDs (U5.25)
I2C_SDA: USBHeaders (J5.14 J6.20), LEDs (U5.26)
IR_CLK: CPU (U1.71), IRComms (U4.11 U4.12)
IR_DATA: CPU (U1.92), IRComms (U4.14)
IR_EMIT_0: IRComms (R24.2 U4.15), TestPoints (TP13.1)
IR_EMIT_4: IRComms (R28.2 U4.4), TestPoints (TP14.1)
IR_RECV_0: CPU (U1.10), IRComms (IR1.1), TestPoints (TP11.1)
IR_RECV_1: CPU (U1.11), IRComms (IR2.1)
IR_RECV_2: CPU (U1.12), IRComms (IR3.1)
IR_RECV_3: CPU (U1.13), IRComms (IR4.1)
IR_RECV_4: CPU (U1.95), IRComms (IR5.1), TestPoints (TP12.1)
IR_RECV_5: CPU (U1.96), IRComms (IR6.1)
IR_RECV_6: CPU (U1.99), IRComms (IR7.1)
IR_RECV_7: CPU (U1.100), IRComms (IR8.1)
LED_IR_BEACON: USBHeaders (J6.16), IRComms (Q1.1 R32.2)
LED_IR_COMMS: CPU (U1.72), IRComms (U4.13)
LIGHT_B: CPU (U1.5), LightSensorsButtons (R37.1 R41.1)
LIGHT_FL: CPU (U1.2), LightSensorsButtons (R35.1 R39.1)
LIGHT_FR: CPU (U1.1), LightSensorsButtons (R36.1 R40.1), TestPoints (TP15.1)
MOT0_PWMA: CPU (U1.47), USBHeaders (J6.4), TestPoints (TP6.1)
MOT0_PWMB: CPU (U1.18), USBHeaders (J6.6), TestPoints (TP7.1)
MOT1_PWMA: CPU (U1.66), USBHeaders (J6.8)
MOT1_PWMB: CPU (U1.67), USBHeaders (J6.10)
QEI_0A: CPU (U1.25), USBHeaders (J6.11), TestPoints (TP4.1)
QEI_0B: CPU (U1.23), USBHeaders (J6.13), TestPoints (TP5.1)
QEI_1A: CPU (U1.75), USBHeaders (J6.15)
QEI_1B: CPU (U1.74), USBHeaders (J6.17)
RESET: CPU (J1.10 R60.1 TP1.1 U1.64), USBHeaders (D7.1 J5.3 J6.18), IRComms (U4.10), LEDs (U5.24), SoundChip (U8.3)
SPI_CLK: CPU (U1.28), USBHeaders (J5.4 J6.9 J7.5), SoundChip (U8.28)
SPI_MISO: CPU (R2.2 U1.30), USBHeaders (J5.6 J6.5 J7.7), SoundChip (U8.30)
SPI_MOSI: CPU (R3.2 U1.31), USBHeaders (J5.8 J6.7 J7.3), SoundChip (U8.29)
SPI_SEL_AUDIO_SCI: CPU (U2.12), SoundChip (U8.23)
SPI_SEL_AUDIO_SDI: CPU (U2.11), SoundChip (U8.13)
SPI_SEL_EXPAND0: CPU (U2.9), USBHeaders (J5.10)
SPI_SEL_EXPAND1: CPU (U2.7), USBHeaders (J5.12)
SPI_SEL_MSP430: CPU (U2.14), USBHeaders (J6.3)
SPI_SEL_SD: CPU (U2.10), USBHeaders (J7.2)
SW_BLUE: CPU (U1.59), LightSensorsButtons (R42.1 SW4.3)
SW_GREEN: CPU (U1.60), LightSensorsButtons (R38.1 SW3.3)
SW_RED: CPU (U1.61), LightSensorsButtons (R34.1 SW2.3), TestPoints (TP2.1)
USB_CTS: CPU (U1.22), USBHeaders (U3.11)
VBAT: USBHeaders (J5.9 J6.21), SoundChip (R12.2), TestPoints (TP8.1)